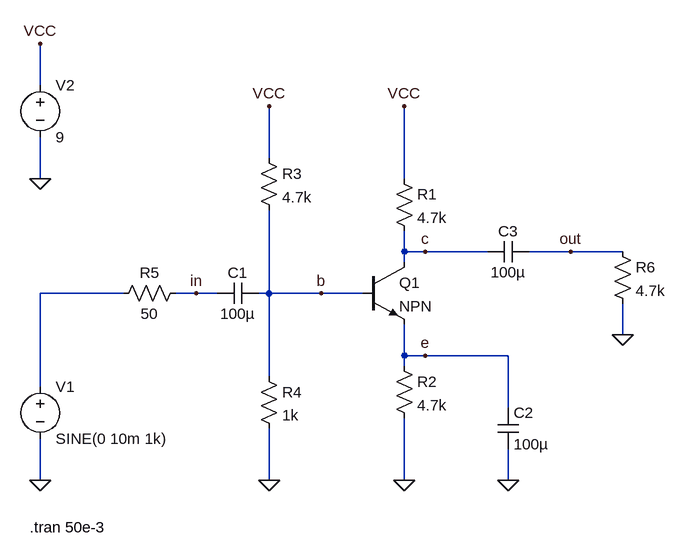
[diagram p0: schematic exercise3.asc]
exercise3.asc, the LTspice schematic file:
Version 4
SHEET 1 880 680
WIRE -304 -160 -304 -224
WIRE 48 -48 48 -128
WIRE -304 -16 -304 -80
WIRE 256 -16 256 -128
WIRE 256 96 256 64
WIRE 288 96 256 96
WIRE 384 96 288 96
WIRE 512 96 448 96
WIRE 592 96 512 96
WIRE 256 112 256 96
WIRE -176 160 -304 160
WIRE -64 160 -96 160
WIRE -32 160 -64 160
WIRE 48 160 48 32
WIRE 48 160 32 160
WIRE 128 160 48 160
WIRE 192 160 128 160
WIRE 592 224 592 176
WIRE 256 256 256 208
WIRE 288 256 256 256
WIRE 416 256 288 256
WIRE 256 272 256 256
WIRE 48 288 48 160
WIRE -304 304 -304 160
WIRE 416 336 416 256
WIRE -304 448 -304 384
WIRE 48 448 48 368
WIRE 256 448 256 352
WIRE 416 448 416 400
FLAG 48 448 0
FLAG 256 448 0
FLAG 48 -128 VCC
FLAG 256 -128 VCC
FLAG 416 448 0
FLAG 592 224 0
FLAG -304 -16 0
FLAG -304 448 0
FLAG -304 -224 VCC
FLAG -64 160 in
FLAG 512 96 out
FLAG 128 160 b
FLAG 288 96 c
FLAG 288 256 e
SYMBOL npn 192 112 R0
SYMATTR InstName Q1
SYMBOL cap 32 144 R90
WINDOW 0 0 32 VBottom 2
WINDOW 3 32 32 VTop 2
SYMATTR InstName C1
SYMATTR Value 100µ
SYMBOL res 240 -32 R0
SYMATTR InstName R1
SYMATTR Value 4.7k
SYMBOL res 240 256 R0
SYMATTR InstName R2
SYMATTR Value 4.7k
SYMBOL res 32 -64 R0
SYMATTR InstName R3
SYMATTR Value 4.7k
SYMBOL res 32 272 R0
SYMATTR InstName R4
SYMATTR Value 1k
SYMBOL cap 400 336 R0
SYMATTR InstName C2
SYMATTR Value 100µ
SYMBOL cap 448 80 R90
WINDOW 0 0 32 VBottom 2
WINDOW 3 32 32 VTop 2
SYMATTR InstName C3
SYMATTR Value 100µ
SYMBOL res 576 80 R0
SYMATTR InstName R6
SYMATTR Value 4.7k
SYMBOL res -80 144 R90
WINDOW 0 0 56 VBottom 2
WINDOW 3 32 56 VTop 2
SYMATTR InstName R5
SYMATTR Value 50
SYMBOL voltage -304 288 R0
WINDOW 123 0 0 Left 0
WINDOW 39 0 0 Left 0
SYMATTR InstName V1
SYMATTR Value SINE(0 10m 1k)
SYMBOL voltage -304 -176 R0
SYMATTR InstName V2
SYMATTR Value 9
TEXT -320 520 Left 2 !.tran 50e-3

The netlist it stands for:
* exercise3.asc
Q1 c b e 0 NPN
C1 b in 100µ
R1 VCC c 4.7k
R2 e 0 4.7k
R3 VCC b 4.7k
R4 b 0 1k
C2 e 0 100µ
C3 out c 100µ
R6 out 0 4.7k
R5 in N001 50
V1 N001 0 SINE(0 10m 1k)
V2 VCC 0 9
.model NPN NPN
.model PNP PNP
.lib standard.bjt
.tran 50e-3
.backanno
.end